# Altium project Kar_PCB.PrjPcb
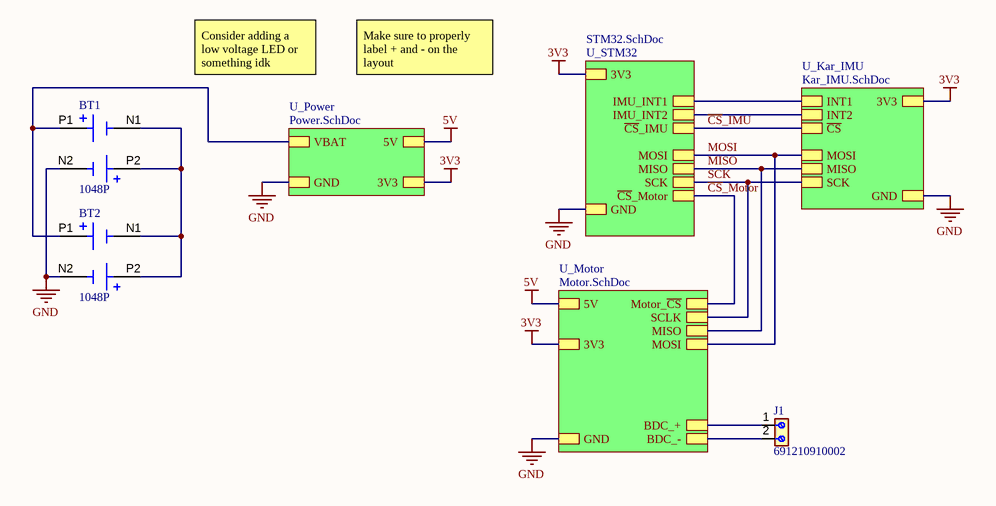
[diagram p0: Kar_PCB.SchDoc]
CAGE_CODE: ?????; CONTRACT_NUMBER: <CONTRACT NO>; DOC_NO_ASSY_DWG: <ASSY DWG NO>; DOC_NO_BOM: <BOM DOC NO>; DOC_NO_FAB_DWG: <FAB DWG NO>; DOC_NO_SCH_DWG: <SCH DWG NO>; PCB_2_DEC_TOL: +/-.01; PCB_3_DEC_TOL: +/-.010; PCB_ANG_TOL: +/-1/2; PCB_ASSEMBLY_NO: <PCB ASSY NO>; PCB_CHECKER: - -----; PCB_CHECKER_APP_DATE: --/--/----; PCB_DESIGNER: - -----; PCB_DESIGNER_APP_DATE: --/--/----; PCB_DWG_NO: <PCB DWG NO>; PCB_ENGINEER: - -----; PCB_ENGINEER_APP_DATE: --/--/----; PCB_PART_NUMBER: <PCB PN>; PCB_REV: A; SCH_REV: A
5 sheets, 58 parts. Net scope: strictly hierarchical (ports join the sheet entries above them; power ports are local).
Board file: Kar_PCB.PcbDoc
Sheets:
  Kar_PCB.SchDoc
    U_Motor = Motor.SchDoc
    U_Power = Power.SchDoc
    U_STM32 = STM32.SchDoc
  Magnetometer.SchDoc

## Sheet Kar_PCB.SchDoc
size 241 x 190 mm; SheetNumber: 1; SheetTotal: 5; ENG_APP_DATE: --/--/--; DSN_APP_DATE: --/--/--; CHK_APP_DATE: --/--/--

### Parts
BT1  1048P  [BAT_1048P]
BT2  1048P  [BAT_1048P]
J1  691210910002  [691210910002]

### Sub-sheets
U_Kar_IMU = Kar_IMU.SchDoc (file not in this document): 3V3, GND, ~{CS}, SCK, MISO, MOSI, INT1, INT2
U_Motor = Motor.SchDoc: 5V, GND, BDC_+, BDC_-, MOSI, Motor_~{CS}, SCLK, 3V3, MISO
U_Power = Power.SchDoc: VBAT, GND, 5V, 3V3
U_STM32 = STM32.SchDoc: MOSI, MISO, SCK, 3V3, GND, ~{CS}_Motor, ~{CS}_IMU, IMU_INT2, IMU_INT1

### Nets
3V3: sheet U_Motor/3V3, sheet U_Power/3V3, sheet U_STM32/3V3, sheet U_Kar_IMU/3V3
5V: sheet U_Motor/5V, sheet U_Power/5V
GND: BT1.N2 BT2.N2 ; sheet U_Motor/GND, sheet U_Power/GND, sheet U_STM32/GND, sheet U_Kar_IMU/GND
VBAT: BT1.P1 BT2.P1 ; sheet U_Power/VBAT
~{CS}_IMU: sheet U_STM32/~{CS}_IMU, sheet U_Kar_IMU/~{CS}
~{CS}_Motor: sheet U_Motor/Motor_~{CS}, sheet U_STM32/~{CS}_Motor
MISO: sheet U_Motor/MISO, sheet U_STM32/MISO, sheet U_Kar_IMU/MISO
MOSI: sheet U_Motor/MOSI, sheet U_STM32/MOSI, sheet U_Kar_IMU/MOSI
SCK: sheet U_Motor/SCLK, sheet U_STM32/SCK, sheet U_Kar_IMU/SCK
NetBT1_N1: BT1.N1 BT1.P2 BT2.N1 BT2.P2
NetJ1_1: J1.1 ; sheet U_Motor/BDC_+
NetJ1_2: J1.2 ; sheet U_Motor/BDC_-
NetU4_16: sheet U_STM32/IMU_INT1, sheet U_Kar_IMU/INT1
NetU4_17: sheet U_STM32/IMU_INT2, sheet U_Kar_IMU/INT2

### Notes on the sheet
- Consider adding a low voltage LED or something idk
- Make sure to properly label + and - on the layout
- DWG. NO.
- REV.
- SHT.
- THIS DOCUMENT AND THE DATA DISCLOSED HEREIN OR HEREWITH IS THE PROPERTY OF ALTIUM LIMITED AND MAY BE FREELY DISTRIBUTED IN WHOLE. NO RIGHTS ARE RESERVED OR EXPRESS OR IMPLIED WARANTEE GIVEN.
- REVISION
- DESCRIPTION
- DATE
- APPROVED
- ENG:
- APPROVALS
- PROJECT
- DSN:
- CHK:
- REFERENCE DOCUMENTS
- PROJECT REVISION:
- TITLE
- DOCUMENT REVISION:
- DESIGN ITEM:
- BOM:
- FAB DWG:
- PCB DWG:
- ASSY DWG:
- SCALE:
- SIZE
- B
- CAGE CODE
- FILE NAME
- DWG NO.
- SHEET
- OF
- REV

### Library data of the parts
BT1 BT2 = 1048P: SMT Polarized Holder for Dual 18650 Batteries; MF: Keystone Electronics; Value: *; MP: 1048P; Price: None; Package: None; Availability: In Stock; SnapEDA_Link: https://www.snapeda.com/parts/1048P/Keystone+Electronics/view-part/?ref=snap; Purchase-URL: https://pricing.snapeda.com/search/part/1048P/?ref=eda; Check_prices: https://www.snapeda.com/parts/1048P/Keystone+Electronics/view-part/?ref=eda
J1 = 691210910002: MF: {'manufacturer': u'W\xfcrth Elektronik'}; Package: None; Price: None; Value: *; MP: 691210910002; Availability: Unavailable

## Sheet Motor.SchDoc
size A; SheetNumber: 3; SheetTotal: 5
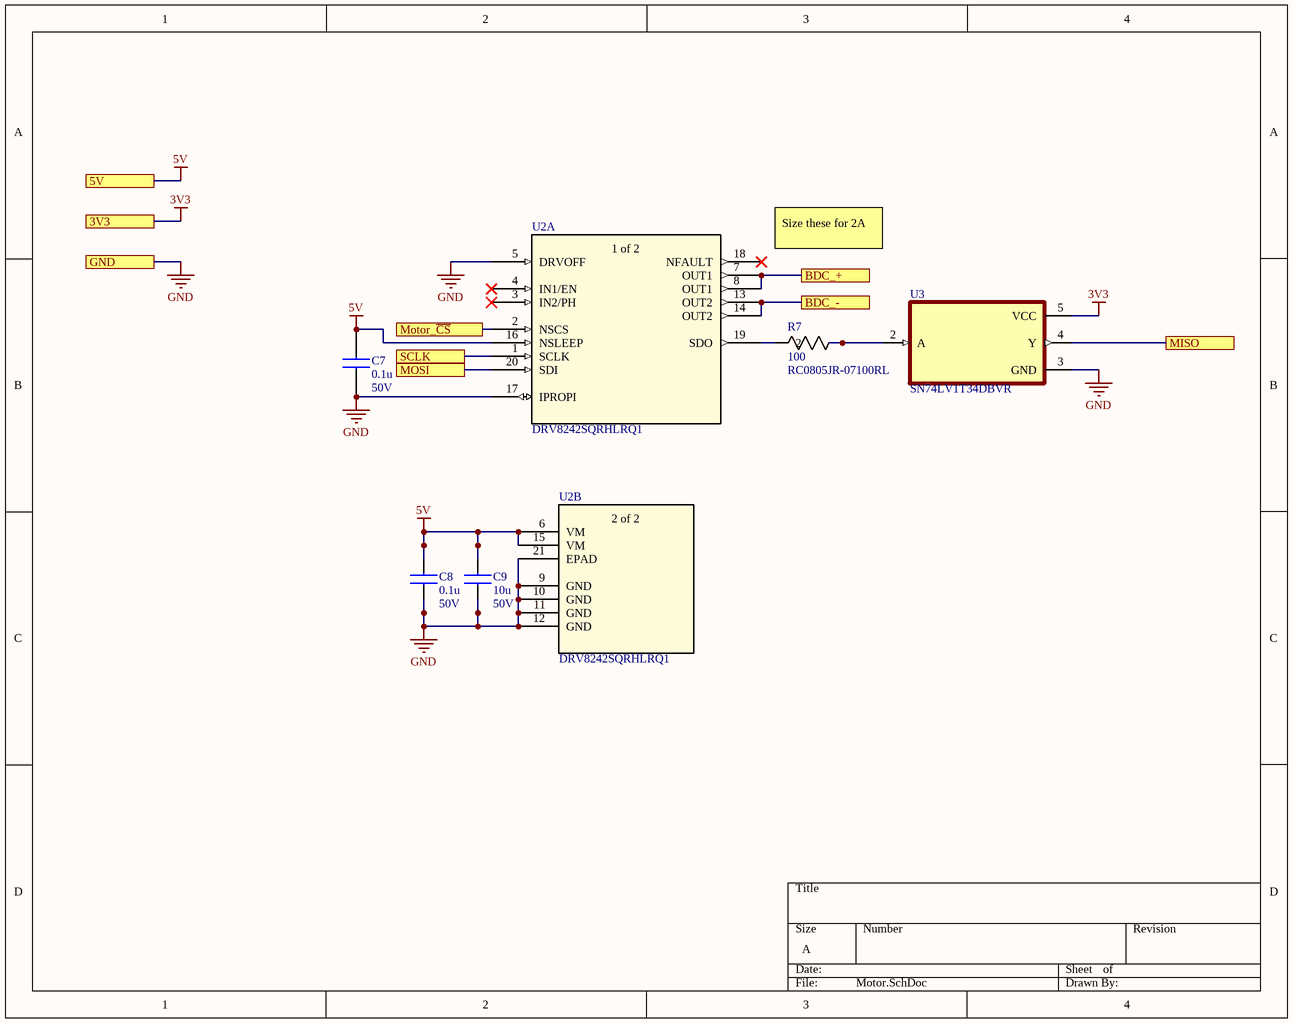
[diagram p1: Motor.SchDoc]

### Parts
C7  value 0.1u  Rated Voltage: 50V  [CAPC2012X145N]  (hidden comment: KAM21BR71H104JM)
C8  value 0.1u  Rated Voltage: 50V  [CAPC2012X145N]  (hidden comment: KAM21BR71H104JM)
C9  value 10u  Rated Voltage: 50V  [CAPC2012X145N]  (hidden comment: C2012X5R1H106K125AC)
R7  RC0805JR-07100RL  value 100  [RC0805N_YAG]
U2  DRV8242SQRHLRQ1  [VQFN20_RHL_TEX]  (parts A,B of 2)
U3  SN74LV1T34DBVR  [SOT95P280X145-5N]

### Ports
3V3, 5V, BDC_+, BDC_-, GND, MISO, MOSI, Motor_~{CS}, SCLK

### Nets
3V3: U3.5(VCC) ; port 3V3
5V: C7.2 C8.2 C9.2 U2.6(VM) U2.15(VM) U2.16(NSLEEP) ; port 5V
GND: C7.1 C8.1 C9.1 U2.5(DRVOFF) U2.9(GND) U2.10(GND) U2.11(GND) U2.12(GND) U2.17(IPROPI) U2.21(EPAD) U3.3(GND) ; port GND
~{CS}_Motor: U2.2(NSCS) ; port Motor_~{CS}
MISO: U3.4(Y) ; port MISO
MOSI: U2.20(SDI) ; port MOSI
SCK: U2.1(SCLK) ; port SCLK
NetJ1_1: U2.7(OUT1) U2.8(OUT1) ; port BDC_+
NetJ1_2: U2.13(OUT2) U2.14(OUT2) ; port BDC_-
NetR7_1: R7.1 U3.2(A)
NetR7_2: R7.2 U2.19(SDO)

Not connected (* = marked no-connect by the designer): U2 3(IN2/PH)* 4(IN1/EN)* 18(NFAULT)*

### Notes on the sheet
- Size these for 2A
- (in symbol DRV8242SQRHLRQ1, part A) 1 of 2
- (in symbol DRV8242SQRHLRQ1, part B) 2 of 2

### Library data of the parts
C7 C8 = KAM21BR71H104JM: Multilayer Ceramic Chip Capacitors, Capacitance=0.1u; Manufacturer_Part_Number: KAM21BR71H104JM
C9 = C2012X5R1H106K125AC: Multilayer Ceramic Chip Capacitors, Capacitance=10?F, LxWxT:2x1.25x1.25mm; Manufacturer_Name: TDK; Geometry.Height: 1.45mm; Mouser Part Number: 810-C2012X5R1H106K12; Mouser Price/Stock: https://www.mouser.co.uk/ProductDetail/TDK/C2012X5R1H106K125AC?qs=rSMjJ%252B1ewcQGpfDVduhUmg%3D%3D; Manufacturer_Part_Number: C2012X5R1H106K125AC; Datasheet Link: https://product.tdk.com/info/en/catalog/datasheets/mlcc_commercial_midvoltage_en.pdf
R7 = RC0805JR-07100RL: RES 0805 100 5% 1/8W; Manufacturer_Name: Yageo; Manufacturer_Part_Number: RC0805JR-07100RL; Tolerance: 5%
U2 = DRV8242SQRHLRQ1: Automotive, 40-V 6-A H-bridge driver with integrated current sensing and feedback 20-VQFN -40 to 125; Manufacturer_Name: Texas Instruments; Type: Power Management; Copyright: Copyright (C) 2025 Ultra Librarian. All rights reserved.; Manufacturer_Part_Number: DRV8242SQRHLRQ1; Datasheet: https://www.ti.com/lit/gpn/drv8242-q1; RefDes: RefDes
U3 = SN74LV1T34DBVR: Single Power Supply BUFFER Logic Level Shifter (no enable); MF: Texas Instruments; SnapEDA_Link: https://www.snapeda.com/parts/SN74LV1T34DBVR/Texas+Instruments/view-part/?ref=snap; Package: SOT-23-5 Texas Instruments; Value: *; MP: SN74LV1T34DBVR; Check_prices: https://www.snapeda.com/parts/SN74LV1T34DBVR/Texas+Instruments/view-part/?ref=eda

## Sheet Power.SchDoc
size A; SheetNumber: 2; SheetTotal: 5
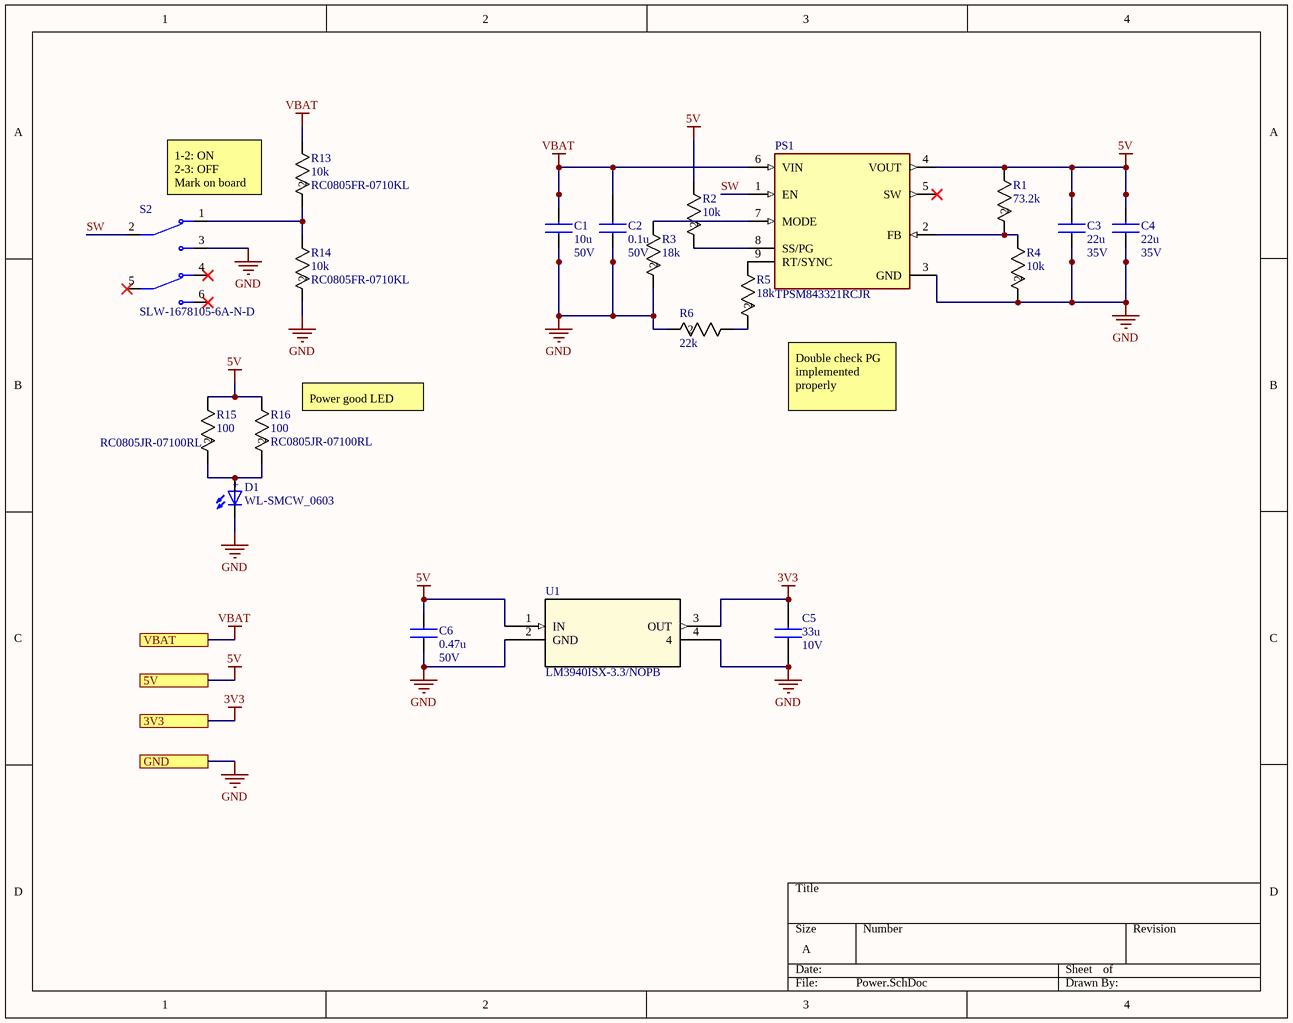
[diagram p2: Power.SchDoc]

### Parts
C1  value 10u  Rated Voltage: 50V  [CAPC2012X145N]  (hidden comment: C2012X5R1H106K125AC)
C2  value 0.1u  Rated Voltage: 50V  [CAPC2012X145N]  (hidden comment: KAM21BR71H104JM)
C3  value 22u  Rated Voltage: 35V  [CAPC2012X145N]  (hidden comment: C2012X5R1V226M125AC)
C4  value 22u  Rated Voltage: 35V  [CAPC2012X145N]  (hidden comment: C2012X5R1V226M125AC)
C5  value 33u  Rated Voltage: 10V  [CAPC2012X145N]  (hidden comment: C2012X5R1A336M125AC)
C6  value 0.47u  Rated Voltage: 50V  [CAPC2012X145N]  (hidden comment: GCM21BR71H474KA55K)
D1  WL-SMCW_0603  [WL-SMCW_0603]
PS1  TPSM843321RCJR  [MODULE_TPSM843321RCJR]
R1  value 73.2k  [RC0805N_YAG]  (hidden comment: RC0805FR-0773K2L)
R2  value 10k  [RC0805N_YAG]  (hidden comment: RC0805FR-0710KL)
R3  value 18k  [RC0805N_YAG]  (hidden comment: RC0805FR-0718KL)
R4  value 10k  [RC0805N_YAG]  (hidden comment: RC0805FR-0710KL)
R5  value 18k  [RC0805N_YAG]  (hidden comment: RC0805FR-0718KL)
R6  value 22k  [RC0805N_YAG]  (hidden comment: RC0805FR-0722KL)
R13  RC0805FR-0710KL  value 10k  [RC0805N_YAG]
R14  RC0805FR-0710KL  value 10k  [RC0805N_YAG]
R15  RC0805JR-07100RL  value 100  [RC0805N_YAG]
R16  RC0805JR-07100RL  value 100  [RC0805N_YAG]
S2  SLW-1678105-6A-N-D  [SW_SLW-1678105-6A-N-D]
U1  LM3940ISX-3.3/NOPB  [TS3B]

### Ports
3V3, 5V, GND, VBAT

### Nets
3V3: C5.2 U1.3(OUT) ; port 3V3
5V: C3.2 C4.2 C6.2 PS1.4(VOUT) R1.1 R2.1 R15.1 R16.1 U1.1(IN) ; port 5V
GND: C1.1 C2.1 C3.1 C4.1 C5.1 C6.1 D1.1(NEG) PS1.3(GND) R3.2 R4.2 R6.2 R14.2 S2.3 U1.2(GND) U1.4 ; port GND
VBAT: C1.2 C2.2 PS1.6(VIN) R13.1 ; port VBAT
SW: PS1.1(EN) S2.2
NetD1_2: D1.2(POS) R15.2 R16.2
NetPS1_2: PS1.2(FB) R1.2 R4.1
NetPS1_7: PS1.7(MODE) R3.1
NetPS1_8: PS1.8(SS/PG) R2.2
NetPS1_9: PS1.9(RT/SYNC) R5.1
NetR5_2: R5.2 R6.1
NetR13_2: R13.2 R14.1 S2.1

Not connected (* = marked no-connect by the designer): PS1 5(SW)*; S2 4* 5* 6*

### Notes on the sheet
- 1-2: ON
  2-3: OFF
  Mark on board
- (near R16) Power good LED
- Double check PG implemented properly
- (in symbol WL-SMCW_0603) +

### Library data of the parts
C1 = C2012X5R1H106K125AC: as C9 on sheet Motor; Mouser Part Number: 810-C2012X5R1H106K12; Mouser Price/Stock: https://www.mouser.co.uk/ProductDetail/TDK/C2012X5R1H106K125AC?qs=rSMjJ%252B1ewcQGpfDVduhUmg%3D%3D; Manufacturer_Part_Number: C2012X5R1H106K125AC; Datasheet Link: https://product.tdk.com/info/en/catalog/datasheets/mlcc_commercial_midvoltage_en.pdf
C2 = KAM21BR71H104JM: as C7 on sheet Motor; Manufacturer_Part_Number: KAM21BR71H104JM
C3 C4 = C2012X5R1V226M125AC: Multilayer Ceramic Chip Capacitors, Capacitance=22u; Manufacturer_Part_Number: C2012X5R1V226M125AC
C5 = C2012X5R1A336M125AC: Multilayer Ceramic Chip Capacitors, Capacitance=33u; Manufacturer_Part_Number: C2012X5R1A336M125AC
C6 = GCM21BR71H474KA55K: Multilayer Ceramic Chip Capacitors, Capacitance=0.47u; Manufacturer_Part_Number: GCM21BR71H474KA55K
D1 = WL-SMCW_0603: 0603, Green Typ.(@20mA): 520nm, 430mcd, 3.2V, 140Â° InGaN; MF: Wurth Electronics; MP: 150060GS75000; SnapEDA_Link: https://www.snapeda.com/parts/150060GS75000/Wurth+Electronics/view-part/?ref=snap; Package: 0603 WÃ¼rth Elektronik; Value: *; Check_prices: https://www.snapeda.com/parts/150060GS75000/Wurth+Electronics/view-part/?ref=eda
PS1 = TPSM843321RCJR: Non-Isolated PoL Module DC DC Converter 1 Output 5V 3A 3.8V - 18V Input; MF: Texas Instruments; SnapEDA_Link: https://www.snapeda.com/parts/TPSM843321RCJR/Texas+Instruments/view-part/?ref=snap; Package: None; Value: *; MP: TPSM843321RCJR; Check_prices: https://www.snapeda.com/parts/TPSM843321RCJR/Texas+Instruments/view-part/?ref=eda
R1 = RC0805FR-0773K2L: RES 0805 73.2k 1% 1/8W; Manufacturer_Name: Yageo; Manufacturer_Part_Number: RC0805FR-0773K2L; Tolerance: 1%
R2 R4 R13 R14 = RC0805FR-0710KL: RES 0805 10k 1% 1/8W; Manufacturer_Name: Yageo; Manufacturer_Part_Number: RC0805FR-0710KL; Tolerance: 1%
R3 R5 = RC0805FR-0718KL: RES 0805 18k 1% 1/8W; Manufacturer_Name: Yageo; Manufacturer_Part_Number: RC0805FR-0718KL; Tolerance: 1%
R6 = RC0805FR-0722KL: RES 0805 22k 1% 1/8W; Manufacturer_Name: Yageo; Manufacturer_Part_Number: RC0805FR-0722KL; Tolerance: 1%
R15 R16 = RC0805JR-07100RL: as R7 on sheet Motor; Manufacturer_Part_Number: RC0805JR-07100RL; Tolerance: 5%
S2 = SLW-1678105-6A-N-D: 16 x 7.8 x 10.5 mm, 6 mm Raised Slide Actuator, Through Hole, Slide Switch; MF: Same Sky; SnapEDA_Link: https://www.snapeda.com/parts/SLW-1678105-6A-N-D/Same+Sky/view-part/?ref=snap; Package: Package; Value: *; MP: SLW-1678105-6A-N-D; Check_prices: https://www.snapeda.com/parts/SLW-1678105-6A-N-D/Same+Sky/view-part/?ref=eda
U1 = LM3940ISX-3.3NOPB: 1-A, low-dropout voltage regulator for 5-V to 3.3-V conversion 3-DDPAK/TO-263 -40 to 125; Manufacturer_Name: Texas Instruments; Type: LM3940IS-3.3; Copyright: Copyright (C) 2025 Ultra Librarian. All rights reserved.; Manufacturer_Part_Number: LM3940ISX-3.3/NOPB; Datasheet: https://www.ti.com/lit/gpn/lm3940; RefDes: RefDes

## Sheet STM32.SchDoc
size A; SheetNumber: 4; SheetTotal: 5
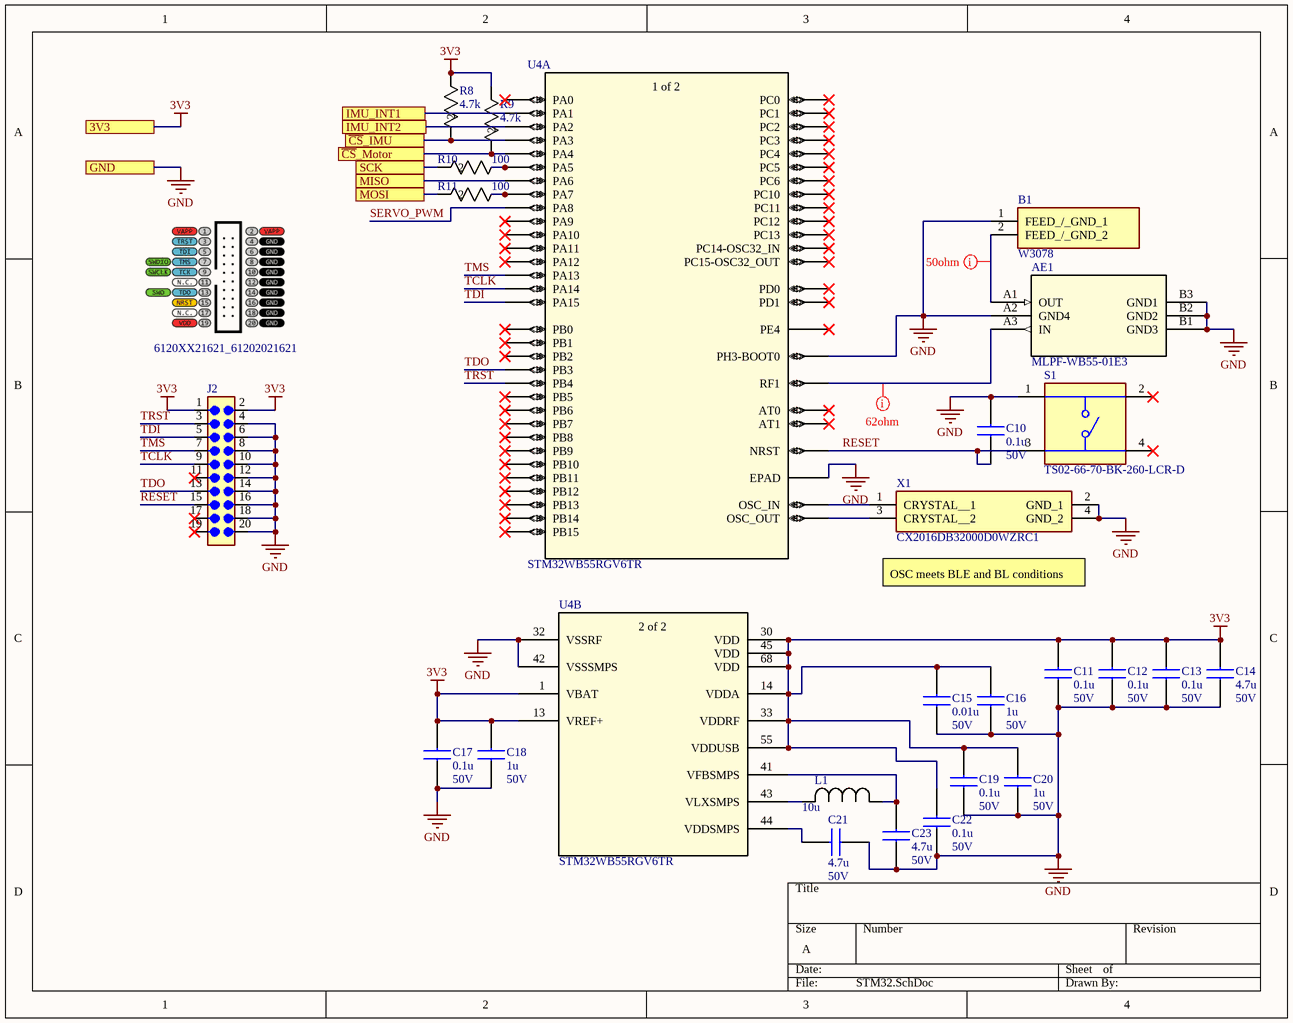
[diagram p3: STM32.SchDoc]

### Parts
AE1  MLPF-WB55-01E3  [MLPF-WB55-01E3_STM]
B1  W3078  [W3078]
C10  value 0.1u  Rated Voltage: 50V  [CAPC2012X145N]  (hidden comment: KAM21BR71H104JM)
C11  value 0.1u  Rated Voltage: 50V  [CAPC2012X145N]  (hidden comment: KAM21BR71H104JM)
C12  value 0.1u  Rated Voltage: 50V  [CAPC2012X145N]  (hidden comment: KAM21BR71H104JM)
C13  value 0.1u  Rated Voltage: 50V  [CAPC2012X145N]  (hidden comment: KAM21BR71H104JM)
C14  value 4.7u  Rated Voltage: 50V  [CAPC2012X145N]  (hidden comment: C2012X5R1H475M125AB)
C15  value 0.01u  Rated Voltage: 50V  [CAPC2012X145N]  (hidden comment: KAM21BR71H103KT)
C16  value 1u  Rated Voltage: 50V  [CAPC2012X145N]  (hidden comment: KGM21AR51H105KU)
C17  value 0.1u  Rated Voltage: 50V  [CAPC2012X145N]  (hidden comment: KAM21BR71H104JM)
C18  value 1u  Rated Voltage: 50V  [CAPC2012X145N]  (hidden comment: KGM21AR51H105KU)
C19  value 0.1u  Rated Voltage: 50V  [CAPC2012X145N]  (hidden comment: KAM21BR71H104JM)
C20  value 1u  Rated Voltage: 50V  [CAPC2012X145N]  (hidden comment: KGM21AR51H105KU)
C21  value 4.7u  Rated Voltage: 50V  [CAPC2012X145N]  (hidden comment: C2012X5R1H475M125AB)
C22  value 0.1u  Rated Voltage: 50V  [CAPC2012X145N]  (hidden comment: KAM21BR71H104JM)
C23  value 4.7u  Rated Voltage: 50V  [CAPC2012X145N]  (hidden comment: C2012X5R1H475M125AB)
J2  6120XX21621_61202021621  [61202021621]
L1  value 10u  [IND_LQM21FN100M80L_MUR]  (hidden comment: LQM21FN100M80L)
R8  value 4.7k  [RC0805N_YAG]  (hidden comment: RC0805JR-074K7L)
R9  value 4.7k  [RC0805N_YAG]  (hidden comment: RC0805JR-074K7L)
R10  value 100  [RC0805N_YAG]  (hidden comment: RC0805JR-07100RL)
R11  value 100  [RC0805N_YAG]  (hidden comment: RC0805JR-07100RL)
S1  TS02-66-70-BK-260-LCR-D  [SW_TS02-66-70-BK-260-LCR-D]
U4  STM32WB55RGV6TR  [VFQFN68-8x8mm]  (parts A,B of 2)
X1  CX2016DB32000D0WZRC1  [CX2016DB32000D0WZRC1]

### Ports
3V3, GND, IMU_INT1, IMU_INT2, MISO, MOSI, SCK, ~{CS}_IMU, ~{CS}_Motor

### Nets
3V3: C11.2 C12.2 C13.2 C14.2 C15.2 C16.2 C17.2 C18.2 C19.2 C20.2 C22.2 J2.1 J2.2 R8.1 R9.1 U4.1(VBAT) U4.13(VREF+) U4.14(VDDA) U4.30(VDD) U4.33(VDDRF) U4.45(VDD) U4.55(VDDUSB) U4.68(VDD) ; port 3V3
GND: AE1.A2(GND4) AE1.B1(GND3) AE1.B2(GND2) AE1.B3(GND1) B1.1(FEED_/_GND_1) C10.2 C11.1 C12.1 C13.1 C14.1 C15.1 C16.1 C17.1 C18.1 C19.1 C20.1 C21.1 C22.1 C23.1 J2.4 J2.6 J2.8 J2.10 J2.12 J2.14 J2.16 J2.18 J2.20 S1.1 U4.5(PH3-BOOT0) U4.32(VSSRF) U4.42(VSSSMPS) U4.69(EPAD) X1.2(GND_1) X1.4(GND_2) ; port GND
~{CS}_IMU: R8.2 U4.18(PA3) ; port ~{CS}_IMU
~{CS}_Motor: R9.2 U4.19(PA4) ; port ~{CS}_Motor
MISO: U4.21(PA6) ; port MISO
MOSI: R11.2 ; port MOSI
RESET: C10.1 J2.15 S1.3 U4.8(NRST)
SCK: R10.2 ; port SCK
SERVO_PWM: U4.23(PA8)
TCLK: J2.9 U4.56(PA14)
TDI: J2.5 U4.57(PA15)
TDO: J2.13 U4.63(PB3)
TMS: J2.7 U4.54(PA13)
TRST: J2.3 U4.64(PB4)
NetAE1_A1: AE1.A1(OUT) B1.2(FEED_/_GND_2)
NetAE1_A3: AE1.A3(IN) U4.31(RF1)
NetC21_2: C21.2 U4.44(VDDSMPS)
NetC23_2: C23.2 L1.1 U4.41(VFBSMPS)
NetL1_2: L1.2 U4.43(VLXSMPS)
NetR10_1: R10.1 U4.20(PA5)
NetR11_1: R11.1 U4.22(PA7)
NetU4_16: U4.16(PA1) ; port IMU_INT1
NetU4_17: U4.17(PA2) ; port IMU_INT2
NetU4_34: U4.34(OSC_OUT) X1.3(CRYSTAL__2)
NetU4_35: U4.35(OSC_IN) X1.1(CRYSTAL__1)

Not connected (* = marked no-connect by the designer): J2 11* 17* 19*; S1 2* 4*; U4 2(PC13)* 3(PC14-OSC32_IN)* 4(PC15-OSC32_OUT)* 6(PB8)* 7(PB9)* 9(PC0)* 10(PC1)* 11(PC2)* 12(PC3)* 15(PA0)* 24(PA9)* 25(PC4)* 26(PC5)* 27(PB2)* 28(PB10)* 29(PB11)* 36(AT0)* 37(AT1)* 38(PB0)* 39(PB1)* 40(PE4)* 46(PB12)* 47(PB13)* 48(PB14)* 49(PB15)* 50(PC6)* 51(PA10)* 52(PA11)* 53(PA12)* 58(PC10)* 59(PC11)* 60(PC12)* 61(PD0)* 62(PD1)* 65(PB5)* 66(PB6)* 67(PB7)*

### Layout directives
net class S62: NetAE1_A3
net class S50: NetAE1_A1

### Notes on the sheet
- (near X1) OSC meets BLE and BL conditions
- (in symbol STM32WB55RGV6TR, part A) 1 of 2
- (in symbol STM32WB55RGV6TR, part B) 2 of 2

### Library data of the parts
AE1 = MLPF-WB55-01E3: 2.4 GHz Matched filter companion chip for STM32WB55Cx and STM32WB55Rx; Manufacturer_Name: STMicroelectronics; Copyright: Copyright (C) 2025 Ultra Librarian. All rights reserved.; Manufacturer_Part_Number: MLPF-WB55-01E3; Datasheet: https://www.st.com/resource/en/datasheet/mlpf-wb55-01e3.pdf; RefDes: RefDes; Type: Type
B1 = W3078: Antennas CERAMIC W3078 GC380H N; Manufacturer_Name: PULSE; Geometry.Height: 1.2mm; Mouser Part Number: 673-W3078; Mouser Price/Stock: https://www.mouser.co.uk/ProductDetail/Pulse-Electronics/W3078?qs=k0bvAmZt86CkgrK3%2FGxl6Q%3D%3D; Manufacturer_Part_Number: W3078; Datasheet Link: https://datasheet.datasheetarchive.com/originals/distributors/DKDS-10/182581.pdf
C10-C13 C17 C19 C22 = KAM21BR71H104JM: as C7 on sheet Motor; Manufacturer_Part_Number: KAM21BR71H104JM
C14 C21 C23 = C2012X5R1H475M125AB: Multilayer Ceramic Chip Capacitors, Capacitance=4.7u; Manufacturer_Part_Number: GCM21BR71H474KA55K
C15 = KAM21BR71H103KT: Multilayer Ceramic Chip Capacitors, Capacitance=0.01u; Manufacturer_Part_Number: KAM21BR71H103KT
C16 C18 C20 = KGM21AR51H105KU: Multilayer Ceramic Chip Capacitors, Capacitance=1u; Manufacturer_Part_Number: KGM21AR51H105KU
J2 = 6120XX21621_61202021621: MF: {'manufacturer': u'W\xfcrth Elektronik'}; Package: None; Price: None; Value: *; MP: 61202021621; Availability: Unavailable
L1 = LQM21FN100M80L: No Description Available; Manufacturer_Name: Murata; Copyright: Copyright (C) 2025 Ultra Librarian. All rights reserved.; Manufacturer_Part_Number: LQM21FN100M80L
R8 R9 = RC0805JR-074K7L: RES 0805 4.7k 5% 1/8W; Manufacturer_Name: Yageo; Manufacturer_Part_Number: RC0805JR-074K7L; Tolerance: 5%
R10 R11 = RC0805JR-07100RL: as R7 on sheet Motor; Manufacturer_Part_Number: RC0805JR-07100RL; Tolerance: 5%
S1 = TS02-66-70-BK-260-LCR-D: 6 x 6 mm, 7 mm Actuator Height, 260 gf, Black, Long Crimped, Through Hole, SPST, Tactile Switch; MF: Same Sky; SnapEDA_Link: https://www.snapeda.com/parts/TS02-66-70-BK-260-LCR-D/Same+Sky/view-part/?ref=snap; Package: None; Value: *; MP: TS02-66-70-BK-260-LCR-D; Check_prices: https://www.snapeda.com/parts/TS02-66-70-BK-260-LCR-D/Same+Sky/view-part/?ref=eda
U4 = STM32WB55RGV6TR: Ultra-low-power dual core Arm Cortex-M4 MCU 64 MHz, Cortex-M0+ 32 MHz with 1 Mbyte of Flash memory, Bluetooth LE 5.4, 802.15.4, Zigbee, Thread, Matter, USB, LCD, AES-256; Manufacturer_Name: STMicroelectronics; Copyright: Copyright (C) 2025 Ultra Librarian. All rights reserved.; Manufacturer_Part_Number: STM32WB55RGV6TR; Datasheet: https://www.st.com/resource/en/datasheet/stm32wb55cc.pdf; RefDes: RefDes; Type: Type
X1 = CX2016DB32000D0WZRC1: 32 MHz +/-25ppm Crystal 8pF 60 Ohms 4-SMD, No Lead; Manufacturer_Name: Kyocera AVX; Geometry.Height: 0.45mm; Mouser Part Number: 581-CX2016DB32DWZRC1; Mouser Price/Stock: https://www.mouser.co.uk/ProductDetail/KYOCERA-AVX/CX2016DB32000D0WZRC1?qs=mHG8nxlouK5LiZGb%2FcBxwg%3D%3D; Manufacturer_Part_Number: CX2016DB32000D0WZRC1; Datasheet Link: https://ele.kyocera.com/assets/products/crystal-device/cx2016db_e.pdf

## Sheet Magnetometer.SchDoc
size A; SheetNumber: 6; SheetTotal: 6
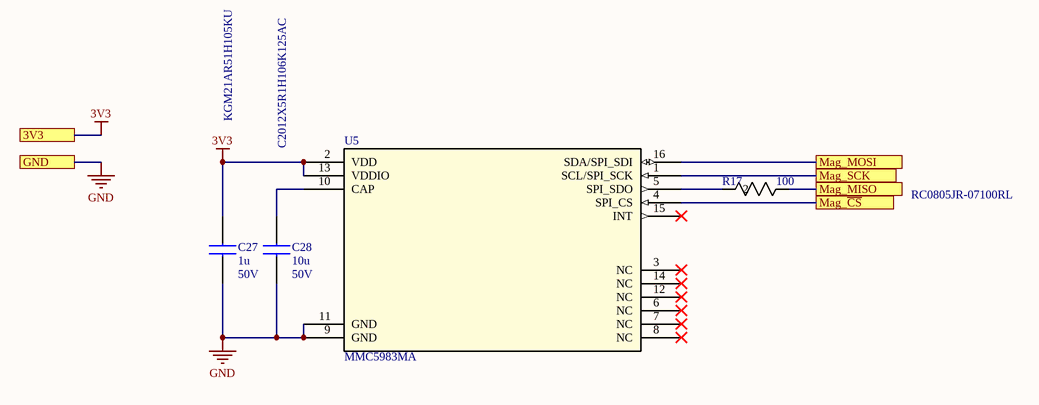
[diagram p4: Magnetometer.SchDoc]

### Parts
C27  KGM21AR51H105KU  value 1u  Rated Voltage: 50V  [CAPC2012X145N]
C28  C2012X5R1H106K125AC  value 10u  Rated Voltage: 50V  [CAPC2012X145N]
R17  RC0805JR-07100RL  value 100  [RC0805N_YAG]
U5  MMC5983MA  [MMC5983MA_MEM]

### Ports
3V3, GND, Mag_MISO, Mag_MOSI, Mag_SCK, Mag_~{CS}

### Nets
3V3: C27.2 U5.2(VDD) U5.13(VDDIO) ; port 3V3
GND: C27.1 C28.1 U5.9(GND) U5.11(GND) ; port GND
NetC28_2: C28.2 U5.10(CAP)
NetR17_1: R17.1 ; port Mag_MISO
NetR17_2: R17.2 U5.5(SPI_SDO)
NetU5_1: U5.1(SCL/SPI_SCK) ; port Mag_SCK
NetU5_4: U5.4(SPI_CS) ; port Mag_~{CS}
NetU5_16: U5.16(SDA/SPI_SDI) ; port Mag_MOSI

Not connected (* = marked no-connect by the designer): U5 3(NC)* 6(NC)* 7(NC)* 8(NC)* 12(NC)* 14(NC)* 15(INT)*

### Library data of the parts
C27 = KGM21AR51H105KU: as C16 on sheet STM32; Manufacturer_Part_Number: KGM21AR51H105KU
C28 = C2012X5R1H106K125AC: as C9 on sheet Motor; Mouser Part Number: 810-C2012X5R1H106K12; Mouser Price/Stock: https://www.mouser.co.uk/ProductDetail/TDK/C2012X5R1H106K125AC?qs=rSMjJ%252B1ewcQGpfDVduhUmg%3D%3D; Manufacturer_Part_Number: C2012X5R1H106K125AC; Datasheet Link: https://product.tdk.com/info/en/catalog/datasheets/mlcc_commercial_midvoltage_en.pdf
R17 = RC0805JR-07100RL: as R7 on sheet Motor; Manufacturer_Part_Number: RC0805JR-07100RL; Tolerance: 5%
U5 = MMC5983MA: No Description Available; Manufacturer_Name: Memsic; Copyright: Copyright (C) 2025 Ultra Librarian. All rights reserved.; Manufacturer_Part_Number: MMC5983MA; RefDes: RefDes; Type: Type

## Nets that join several sheets
3V3: Motor (U3.5), Power (C5.2 U1.3), STM32 (23 pins)
5V: Motor (6 pins), Power (9 pins)
GND: Kar_PCB (BT1.N2 BT2.N2), Motor (11 pins), Power (15 pins), STM32 (35 pins)
VBAT: Kar_PCB (BT1.P1 BT2.P1), Power (C1.2 C2.2 PS1.6 R13.1)
~{CS}_Motor: Motor (U2.2), STM32 (R9.2 U4.19)
MISO: Motor (U3.4), STM32 (U4.21)
MOSI: Motor (U2.20), STM32 (R11.2)
NetJ1_1: Kar_PCB (J1.1), Motor (U2.7 U2.8)
NetJ1_2: Kar_PCB (J1.2), Motor (U2.13 U2.14)
SCK: Motor (U2.1), STM32 (R10.2)